# EAGLE schematic out8 (EAGLE 6.2)
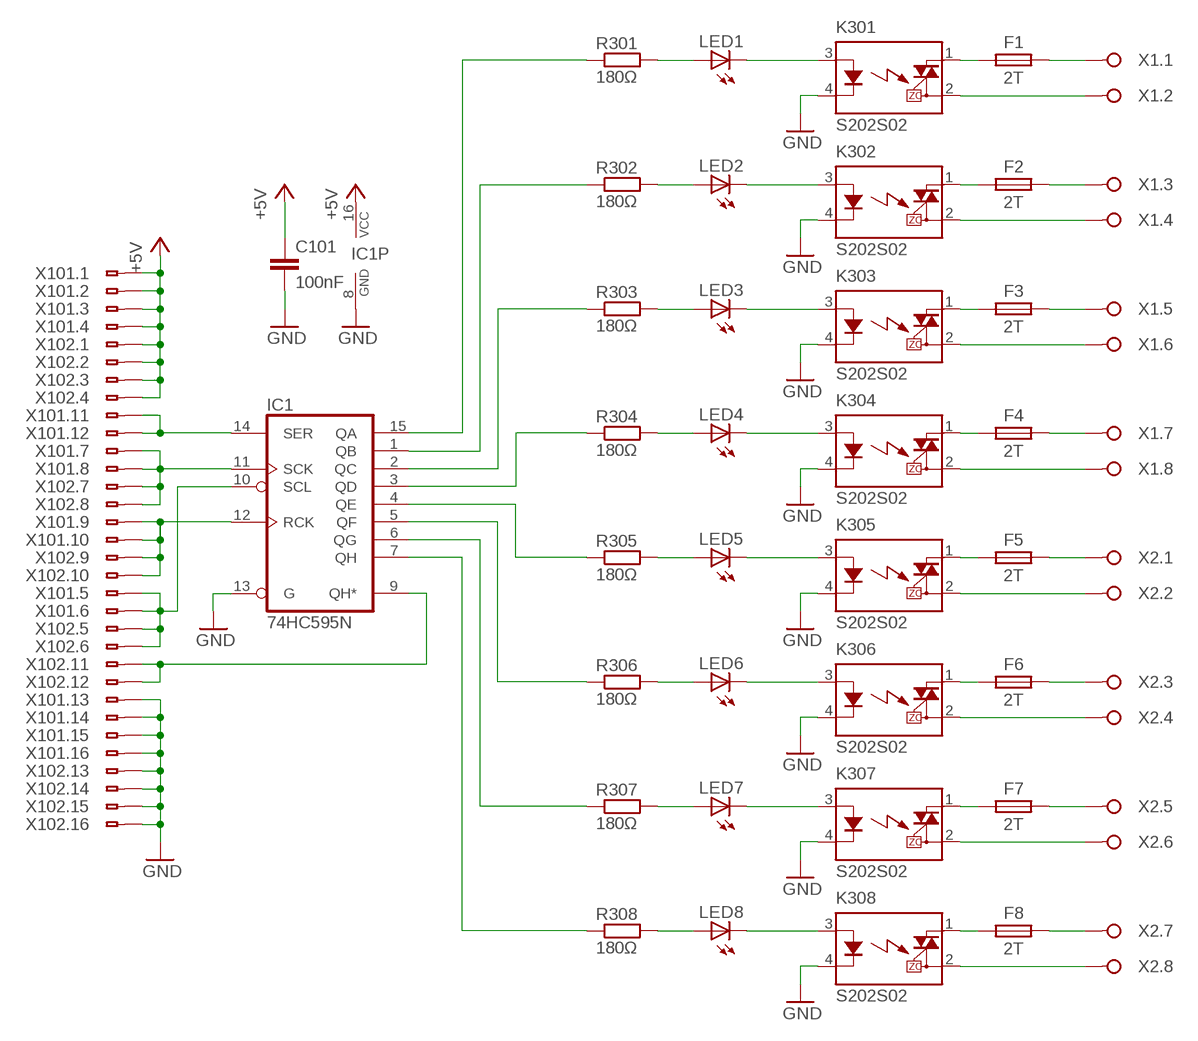
[diagram p0: schematic, sheet 1]

## Parts
C101  100nF  C_025-025X050  [C025-025X050]
F1  2T  TR5  [TR5]
F2  2T  TR5  [TR5]
F3  2T  TR5  [TR5]
F4  2T  TR5  [TR5]
F5  2T  TR5  [TR5]
F6  2T  TR5  [TR5]
F7  2T  TR5  [TR5]
F8  2T  TR5  [TR5]
IC1  74HC595N  [DIL16]
K301  S202S02  [SIP4]
K302  S202S02  [SIP4]
K303  S202S02  [SIP4]
K304  S202S02  [SIP4]
K305  S202S02  [SIP4]
K306  S202S02  [SIP4]
K307  S202S02  [SIP4]
K308  S202S02  [SIP4]
LED1  LED3MM  [LED3MM]
LED2  LED3MM  [LED3MM]
LED3  LED3MM  [LED3MM]
LED4  LED3MM  [LED3MM]
LED5  LED3MM  [LED3MM]
LED6  LED3MM  [LED3MM]
LED7  LED3MM  [LED3MM]
LED8  LED3MM  [LED3MM]
R301  180Ω  R_0204/7  [0204/7]
R302  180Ω  R_0204/7  [0204/7]
R303  180Ω  R_0204/7  [0204/7]
R304  180Ω  R_0204/7  [0204/7]
R305  180Ω  R_0204/7  [0204/7]
R306  180Ω  R_0204/7  [0204/7]
R307  180Ω  R_0204/7  [0204/7]
R308  180Ω  R_0204/7  [0204/7]
X1  WAGO_236-408  [WAGO_236-408]
X2  WAGO_236-408  [WAGO_236-408]
X101  WS16V  [WS16V]
X102  WS16V  [WS16V]

## Nets
!R: IC1.10(SCL) X101.5 X101.6 X102.5 X102.6
+5V: C101.1 IC1.16(VCC) X101.1 X101.2 X101.3 X101.4 X102.1 X102.2 X102.3 X102.4
C1: IC1.11(SCK) X101.7 X101.8 X102.7 X102.8
C2: IC1.12(RCK) X101.9 X101.10 X102.9 X102.10
D: IC1.14(SER) X101.11 X101.12
GND: C101.2 IC1.8(GND) IC1.13(G) K301.4(K) K302.4(K) K303.4(K) K304.4(K) K305.4(K) K306.4(K) K307.4(K) K308.4(K) X101.13 X101.14 X101.15 X101.16 X102.13 X102.14 X102.15 X102.16
N$1: IC1.15(QA) R301.1
N$2: IC1.1(QB) R302.1
N$3: IC1.2(QC) R303.1
N$4: IC1.3(QD) R304.1
N$5: IC1.4(QE) R305.1
N$6: IC1.5(QF) R306.1
N$7: IC1.6(QG) R307.1
N$8: IC1.7(QH) R308.1
N$9: F1.1 K301.1(DS1)
N$10: F1.2 X1.A1 X1.B1
N$11: K301.2(DS2) X1.A2 X1.B2
N$12: F2.1 K302.1(DS1)
N$13: F2.2 X1.A3 X1.B3
N$14: K302.2(DS2) X1.A4 X1.B4
N$15: F3.1 K303.1(DS1)
N$16: F3.2 X1.A5 X1.B5
N$17: K301.3(A) LED1.K(C)
N$18: K302.3(A) LED2.K(C)
N$19: K303.3(A) LED3.K(C)
N$20: K304.3(A) LED4.K(C)
N$21: K305.3(A) LED5.K(C)
N$22: K306.3(A) LED6.K(C)
N$23: K307.3(A) LED7.K(C)
N$24: K308.3(A) LED8.K(C)
N$25: K303.2(DS2) X1.A6 X1.B6
N$26: F4.1 K304.1(DS1)
N$27: F4.2 X1.A7 X1.B7
N$28: K304.2(DS2) X1.A8 X1.B8
N$29: F5.1 K305.1(DS1)
N$30: F5.2 X2.A1 X2.B1
N$31: K305.2(DS2) X2.A2 X2.B2
N$32: F6.1 K306.1(DS1)
N$33: F6.2 X2.A3 X2.B3
N$34: K306.2(DS2) X2.A4 X2.B4
N$35: F7.1 K307.1(DS1)
N$36: F7.2 X2.A5 X2.B5
N$37: K307.2(DS2) X2.A6 X2.B6
N$38: F8.1 K308.1(DS1)
N$39: F8.2 X2.A7 X2.B7
N$40: K308.2(DS2) X2.A8 X2.B8
N$41: IC1.9(QH*) X102.11 X102.12
N$42: LED1.A R301.2
N$43: LED2.A R302.2
N$44: LED3.A R303.2
N$45: LED4.A R304.2
N$46: LED5.A R305.2
N$47: LED6.A R306.2
N$48: LED7.A R307.2
N$49: LED8.A R308.2

## Library data of the parts
C101 = passiv:C_: CAPACITOR, European symbol
F1-F8 = sicherung:TR5: FUSE Wickmann; OC_FARNELL: unknown; OC_NEWARK: unknown
IC1 = 74xx-eu:74*595: 8-bit SHIFT REGISTER, output latch
K301-K308 = relais:S*02S02: IT(rms) 8A, Zero Cross type SIP 4pin Triac output SSR s102s02.pdf <./eagle/doc/relais/s102s02.pdf>; VDRM: 600
LED1-LED8 = led:LED: LED
R301-R308 = passiv:R_: RESISTOR, European symbol
X1 X2 = anschluss:WAGO_236-408: Anschlussklemme Datasheet: wago236.pdf <./eagle/doc/anschluss/wago236.pdf>
X101 X102 = anschluss:WS16: Wannenstecker 16polig